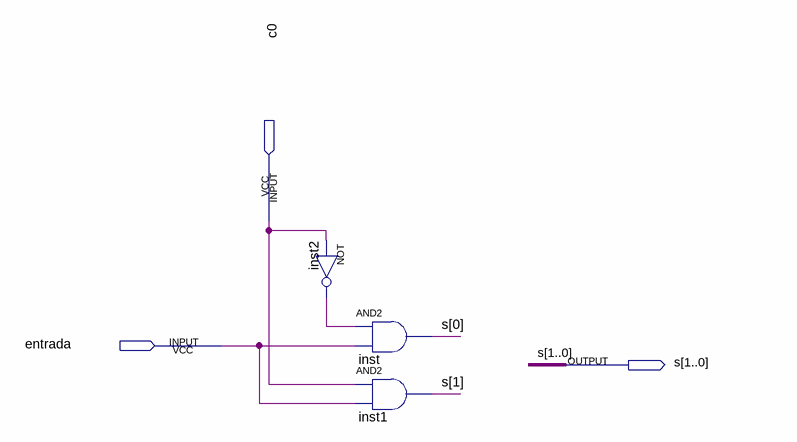
[diagram p0: schematic sheet]
// Quartus schematic deMU2.bdf as structural Verilog: 3 symbols, 3 pins
module deMU2 (
  input  c0,
  input  entrada,
  output [1:0] s
);

  wire inst2_out;

  not inst2 (inst2_out, c0);
  and inst (s[0], inst2_out, entrada);
  and inst1 (s[1], c0, entrada);
endmodule
